# EasyEDA schematic SCH_Carga2BM_2023-11-16.json
TITLE: Sheet_1; REV: 1.0; Date: 2023-11-16; Sheet: 1/1; Drawn By: fabian.figueroa; Company: Your Company
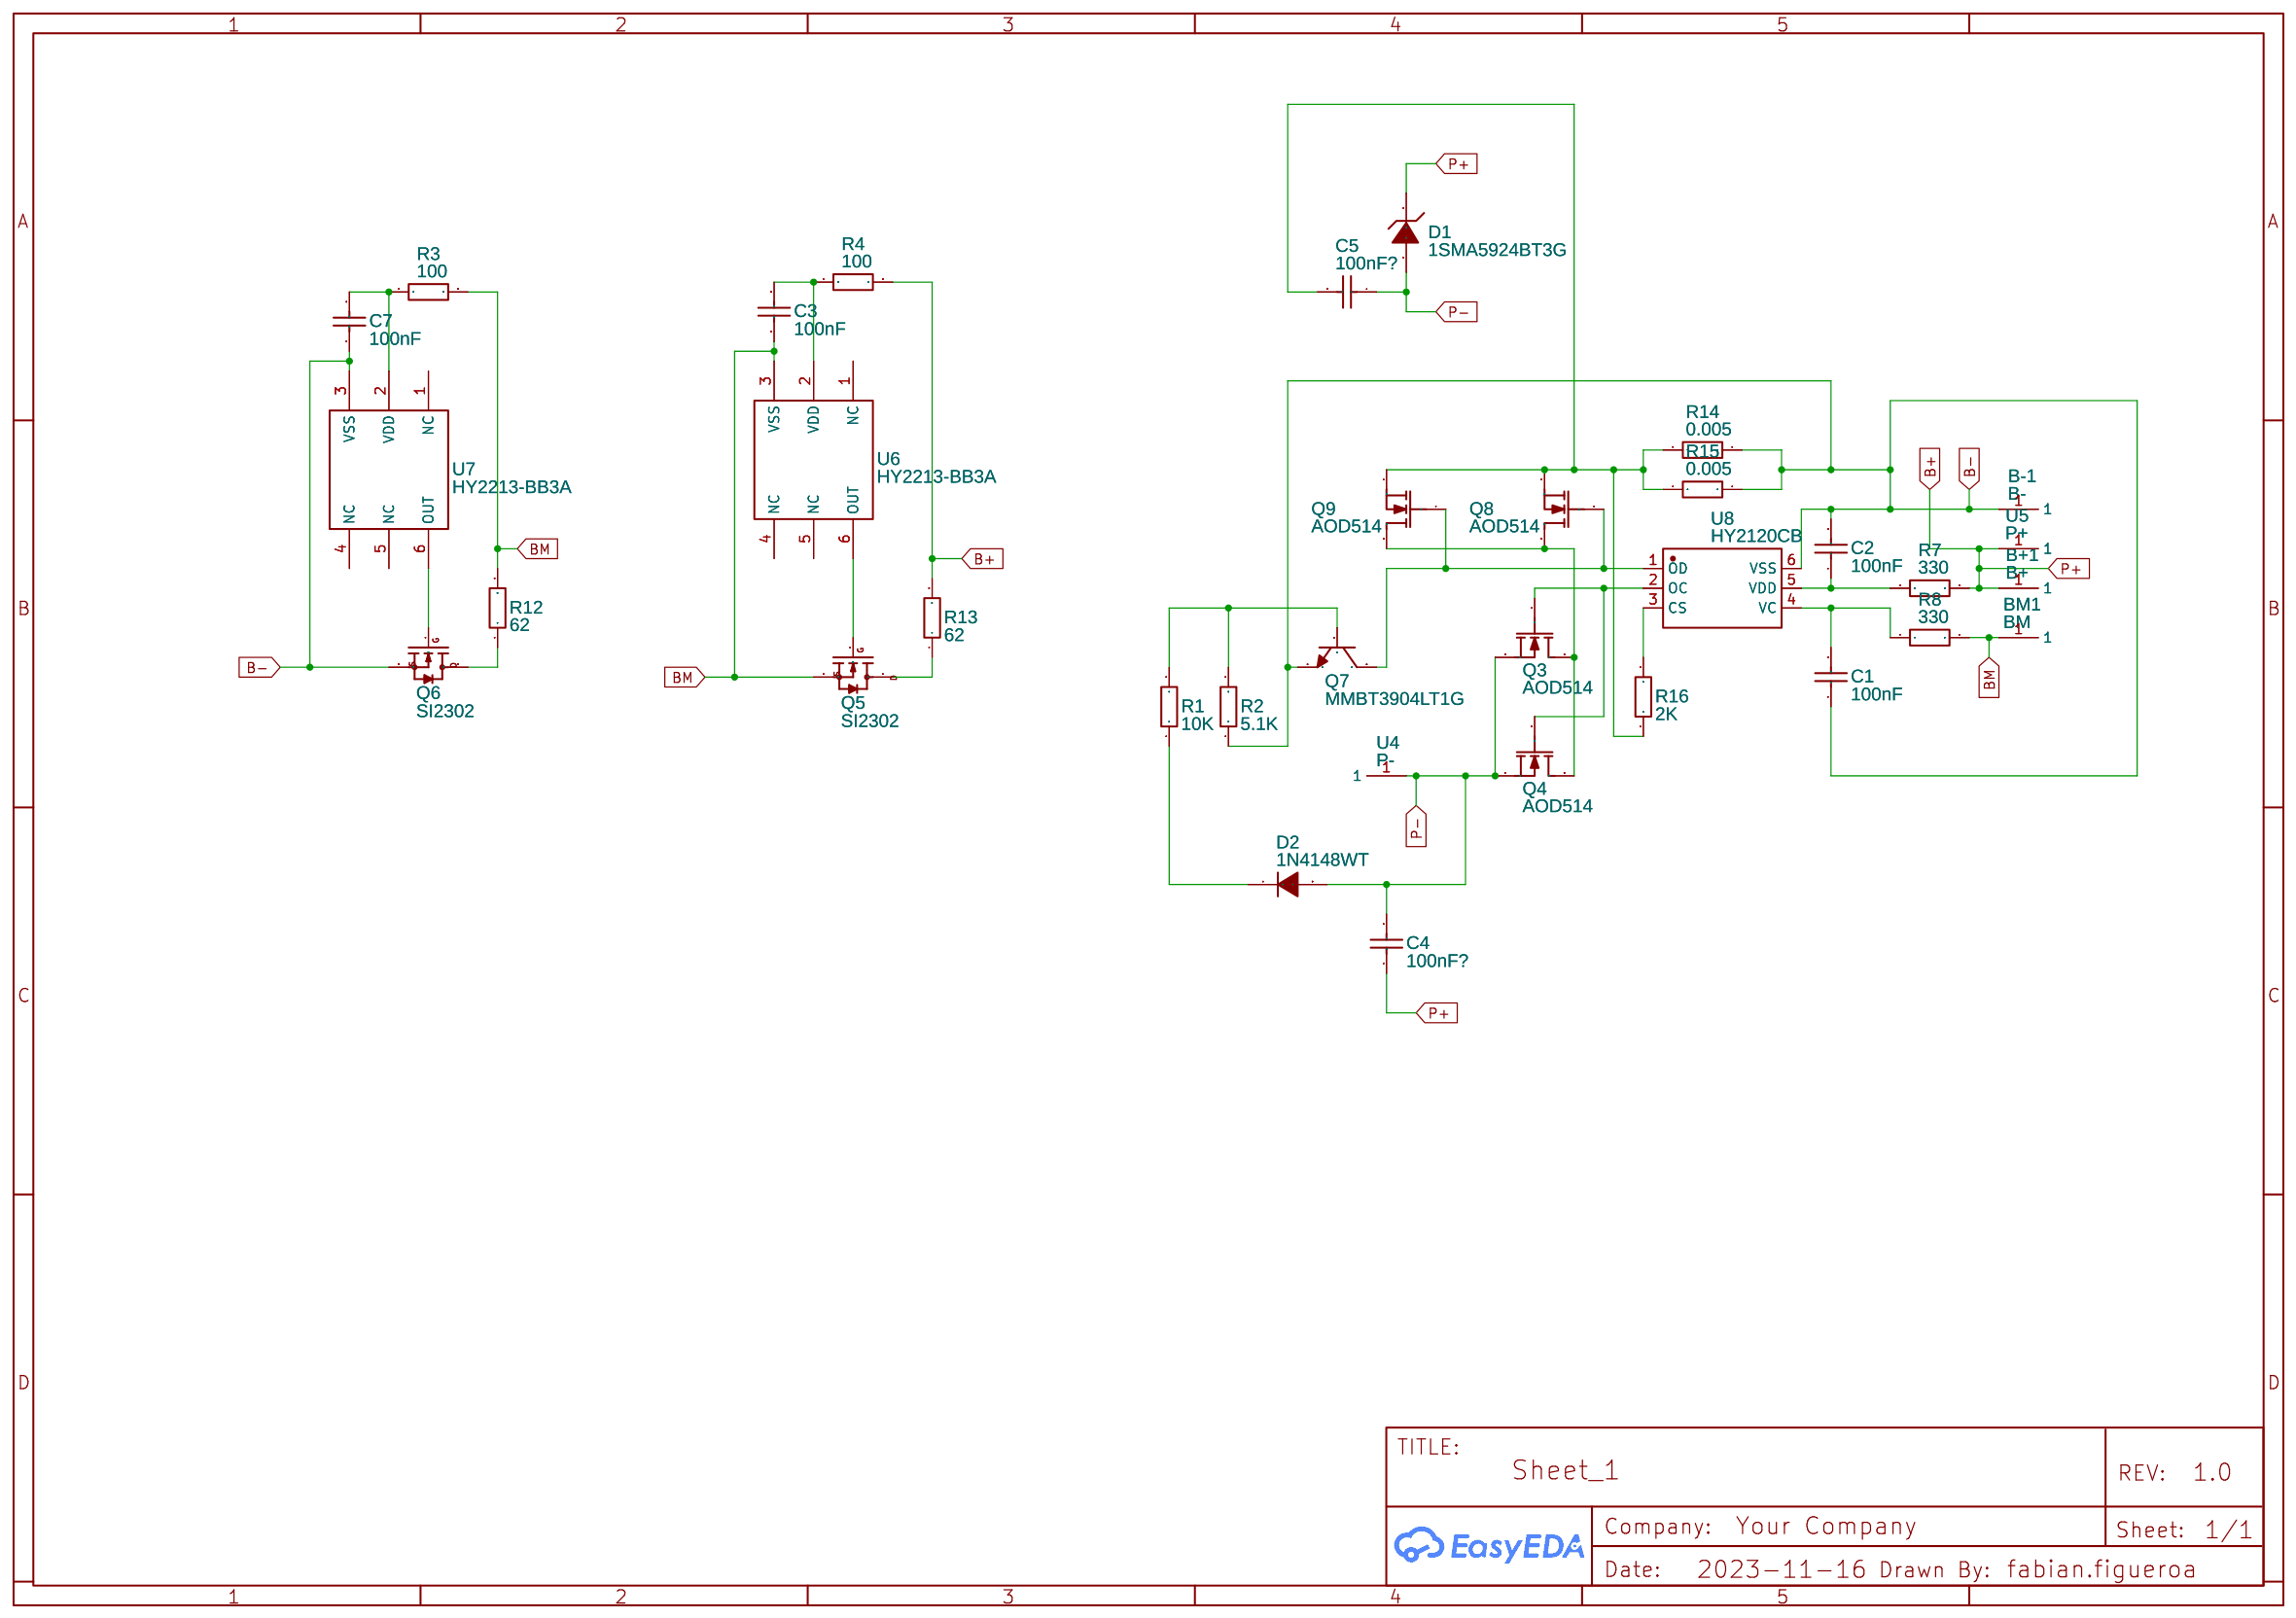
[diagram p0: schematic sheet]

## Parts
B+1  B+  [BATTERY PAD]
B-1  B-  [BATTERY PAD]
BM1  BM  [BATTERY PAD]
C1  100nF  [0603]
C2  100nF  [0603]
C3  100nF  [0603]
C4  100nF?  [0603]
C5  100nF?  [0603]
C7  100nF  [0603]
D1  1SMA5924BT3G  [SMA(DO-214AC)]
D2  1N4148WT  [SOD-523]
Q3  AOD514  [TO252 - D514]
Q4  AOD514  [TO252 - D514]
Q5  SI2302  [SOT-23(SOT-23-3)]
Q6  SI2302  [SOT-23(SOT-23-3)]
Q7  MMBT3904LT1G  [SOT-23(SOT-23-3)]
Q8  AOD514  [TO252 - D514]
Q9  AOD514  [TO252 - D514]
R1  10K  [0603]
R2  5.1K  [0603]
R3  100  [0603]
R4  100  [0603]
R7  330  [0603]
R8  330  [0603]
R12  62  [2512]
R13  62  [2512]
R14  0.005  [2512]
R15  0.005  [2512]
R16  2K  [0603]
U4  P-  [BATTERY PAD]
U5  P+  [BATTERY PAD]
U6  HY2213-BB3A  [SOT-23-6]
U7  HY2213-BB3A  [SOT-23-6]
U8  HY2120CB  [SOT-23-6]

## Library data of the parts
B+1 B-1 BM1 U4 U5 = -: Manufacturer Part: ?; Contributor: ELied
C1-C5 C7 = CL10B104JB8NNNC: Supplier: LCSC; Manufacturer: SAMSUNG; Supplier Part: C24452; LCSC Assembly: Yes; SMT Type: Extend
D1 = -: Supplier: LCSC; Manufacturer: ON; Contributor: LCSC; Supplier Part: C50839; LCSC Assembly: Yes; SMT Type: Extend
D2 = -: Supplier: LCSC; Manufacturer: CJ; image: //image.lceda.cn/szlcsc/C68948.jpg; Supplier Part: C68948; LCSC Assembly: Yes; SMT Type: Extend
Q3 Q4 Q8 Q9 = -: Supplier: LCSC; Supplier Part: C68256; Manufacturer: Alpha & Omega Semicon; Contributor: saidbek
Q5 Q6 = -: Supplier: LCSC; Manufacturer: Hottech; Contributor: LCSC; Supplier Part: C181087; LCSC Assembly: Yes; SMT Type: Extend
Q7 = -: Supplier: LCSC; Manufacturer: ON; Supplier Part: C81464; LCSC Assembly: Yes; SMT Type: Extend
R1 = RMC16K103FTP: Supplier: LCSC; Supplier Part: C323556; Manufacturer: KAMAYA; Contributor: LCSC
R2 = 0603WAF5101T5E: Supplier: LCSC; Manufacturer: UniOhm; LCSC Assembly: Yes; Supplier Part: C23186; SMT Type: Basic
R3 R4 = RTT031000FTP: Supplier: LCSC; Manufacturer: RALEC; Supplier Part: C103197
R7 R8 = 0603WAF3300T5E: Supplier: LCSC; Manufacturer: UniOhm; LCSC Assembly: Yes; Supplier Part: C23138; SMT Type: Basic
R12 R13 = CR2512J62RE04: Supplier: LCSC; Manufacturer: EVER OHMS; Contributor: LCSC; Supplier Part: C165283
R14 R15 = CUM2512-24FR005: Supplier: LCSC; Supplier Part: C323768; Manufacturer: FORT; Contributor: LCSC
R16 = RC0603FR-072KL: Supplier: LCSC; Manufacturer: YAGEO; Supplier Part: C105576
U6 U7 = -: Supplier: LCSC; Manufacturer: HYCON; Supplier Part: C113632; LCSC Assembly: Yes; SMT Type: Extend
U8 = -: Supplier: LCSC; Manufacturer: HYCON; Contributor: LCSC; Supplier Part: C116509; LCSC Assembly: Yes; SMT Type: Extend

## Nets
B+: B+1.1 C4.1 D1.2(K) R4.2 R7.2 R13.2 U5.1
B-: B-1.1 C1.1 C2.2 C7.1 Q6.2(S) Q7.2 R2.1 R14.1 R15.1 U7.3(VSS) U8.6(VSS)
BM: BM1.1 C3.1 Q5.2(S) R3.2 R8.2 R12.2 U6.3(VSS)
P-: C4.2 C5.1 D1.1(A) D2.2(A) Q3.2(S) Q4.2(S) U4.1
Net-(C1-2): C1.2 R8.1 U8.4(VC)
Net-(C2-1): C2.1 R7.1 U8.5(VDD)
Net-(C3-2): C3.2 R4.1 U6.2(VDD)
Net-(C5-2): C5.2 Q8.2(S) Q9.2(S) R14.2 R15.2 R16.1
Net-(C7-2): C7.2 R3.1 U7.2(VDD)
Net-(D2-1): D2.1(K) R1.1
Net-(Q3-1): Q3.1(G) Q4.1(G) U8.2(OC)
Net-(Q3-3): Q3.3(D) Q4.3(D) Q8.3(D) Q9.3(D)
Net-(Q5-1): Q5.1(G) U6.6(OUT)
Net-(Q5-3): Q5.3(D) R13.1
Net-(Q6-1): Q6.1(G) U7.6(OUT)
Net-(Q6-3): Q6.3(D) R12.1
Net-(Q7-1): Q7.1 R1.2 R2.2
Net-(Q7-3): Q7.3 Q8.1(G) Q9.1(G) U8.1(OD)
Net-(R16-2): R16.2 U8.3(CS)

Not connected (* = marked no-connect by the designer): U6 1(NC) 4(NC) 5(NC); U7 1(NC) 4(NC) 5(NC)
